# Altium schematic sheet LCD Screen.SchDoc: Display Connector
size A4; DrawnBy: oaba200
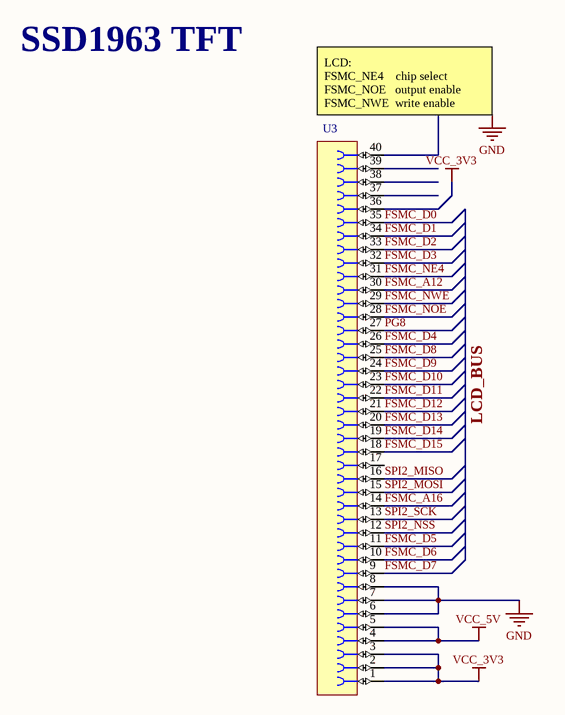
[diagram p0: LCD Screen.SchDoc]

## Parts
U3  (no value)

## Nets
GND: U3.6 U3.7 U3.8 U3.40
VCC_3V3: U3.1 U3.2 U3.3 U3.36
VCC_5V: U3.4 U3.5
FSMC_A12: U3.30
FSMC_A16: U3.14
FSMC_D0: U3.35
FSMC_D1: U3.34
FSMC_D2: U3.33
FSMC_D3: U3.32
FSMC_D4: U3.26
FSMC_D5: U3.11
FSMC_D6: U3.10
FSMC_D7: U3.9
FSMC_D8: U3.25
FSMC_D9: U3.24
FSMC_D10: U3.23
FSMC_D11: U3.22
FSMC_D12: U3.21
FSMC_D13: U3.20
FSMC_D14: U3.19
FSMC_D15: U3.18
FSMC_NE4: U3.31
FSMC_NOE: U3.28
FSMC_NWE: U3.29
PG8: U3.27
SPI2_MISO: U3.16
SPI2_MOSI: U3.15
SPI2_NSS: U3.12
SPI2_SCK: U3.13

Not connected (* = marked no-connect by the designer): U3 17 37 38 39

## Buses and harness runs
bus LCD_BUS

## Notes on the sheet
- SSD1963 TFT
- (near U3) LCD:
  FSMC_NE4    chip select
  FSMC_NOE   output enable
  FSMC_NWE  write enable

## Library data of the parts
U3 = Connector 40 Female